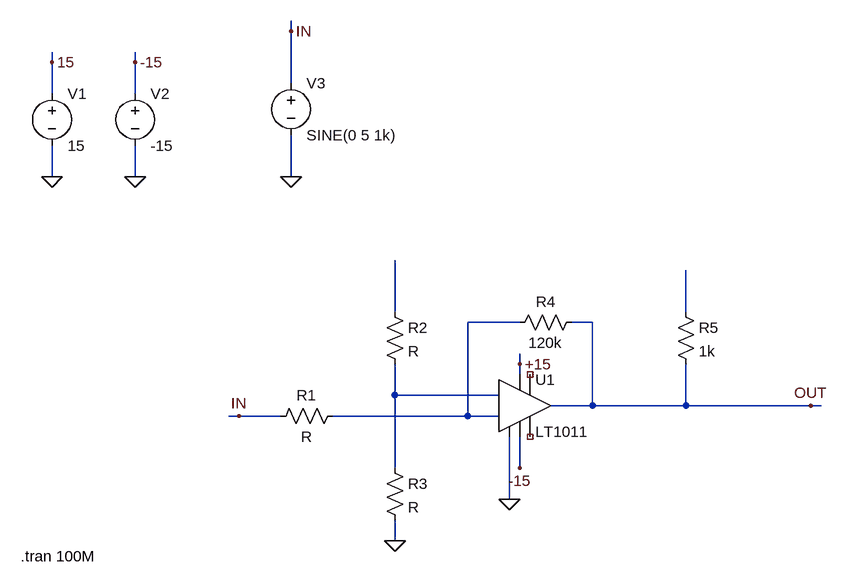
[diagram p0: schematic Integratorcomparator.asc]
Integratorcomparator.asc, the LTspice schematic file:
Version 4
SHEET 1 880 680
WIRE -176 -400 -176 -416
WIRE -544 -352 -544 -368
WIRE -416 -352 -416 -368
WIRE -176 -320 -176 -400
WIRE -544 -304 -544 -352
WIRE -416 -304 -416 -352
WIRE -544 -176 -544 -224
WIRE -416 -176 -416 -224
WIRE -176 -176 -176 -240
WIRE -16 32 -16 -48
WIRE 432 32 432 -32
WIRE 176 48 96 48
WIRE 288 48 256 48
WIRE 176 112 176 96
WIRE 176 128 176 112
WIRE -16 160 -16 112
WIRE 144 160 -16 160
WIRE 288 176 288 48
WIRE 288 176 224 176
WIRE 432 176 432 112
WIRE 432 176 288 176
WIRE 624 176 432 176
WIRE 640 176 624 176
WIRE -256 192 -272 192
WIRE -192 192 -256 192
WIRE 96 192 96 48
WIRE 96 192 -112 192
WIRE 144 192 96 192
WIRE -16 272 -16 160
WIRE 176 272 176 224
WIRE 160 320 160 224
WIRE -16 384 -16 352
FLAG -256 192 IN
FLAG -16 384 0
FLAG 160 320 0
FLAG -544 -176 0
FLAG -416 -176 0
FLAG 624 176 OUT
FLAG 176 112 +15
FLAG 176 272 -15
FLAG -416 -352 -15
FLAG -544 -352 15
FLAG -176 -176 0
FLAG -176 -400 IN
SYMBOL Comparators\\LT1011 176 176 R0
SYMATTR InstName U1
SYMBOL res -96 176 R90
WINDOW 0 0 56 VBottom 2
WINDOW 3 32 56 VTop 2
SYMATTR InstName R1
SYMBOL res -32 16 R0
SYMATTR InstName R2
SYMBOL res -32 256 R0
SYMATTR InstName R3
SYMBOL res 272 32 R90
WINDOW 0 0 56 VBottom 2
WINDOW 3 32 56 VTop 2
SYMATTR InstName R4
SYMATTR Value 120k
SYMBOL res 416 16 R0
SYMATTR InstName R5
SYMATTR Value 1k
SYMBOL voltage -544 -320 R0
WINDOW 123 0 0 Left 2
WINDOW 39 0 0 Left 2
SYMATTR InstName V1
SYMATTR Value 15
SYMBOL voltage -416 -320 R0
WINDOW 123 0 0 Left 2
WINDOW 39 0 0 Left 2
SYMATTR InstName V2
SYMATTR Value -15
SYMBOL voltage -176 -336 R0
WINDOW 123 0 0 Left 2
WINDOW 39 0 0 Left 2
SYMATTR InstName V3
SYMATTR Value SINE(0 5 1k)
TEXT -592 408 Left 2 !.tran 100M

The netlist it stands for:
* Integratorcomparator.asc
XU1 0 N003 N004 -15 NC_01 NC_02 OUT +15 LT1011
R1 N003 IN R
R2 N001 N004 R
R3 N004 0 R
R4 OUT N003 120k
R5 N002 OUT 1k
V1 15 0 15
V2 -15 0 -15
V3 IN 0 SINE(0 5 1k)
.tran 100M
.lib LTC1.lib
.backanno
.end